# EAGLE design FLT04A (EAGLE 6.5.0)
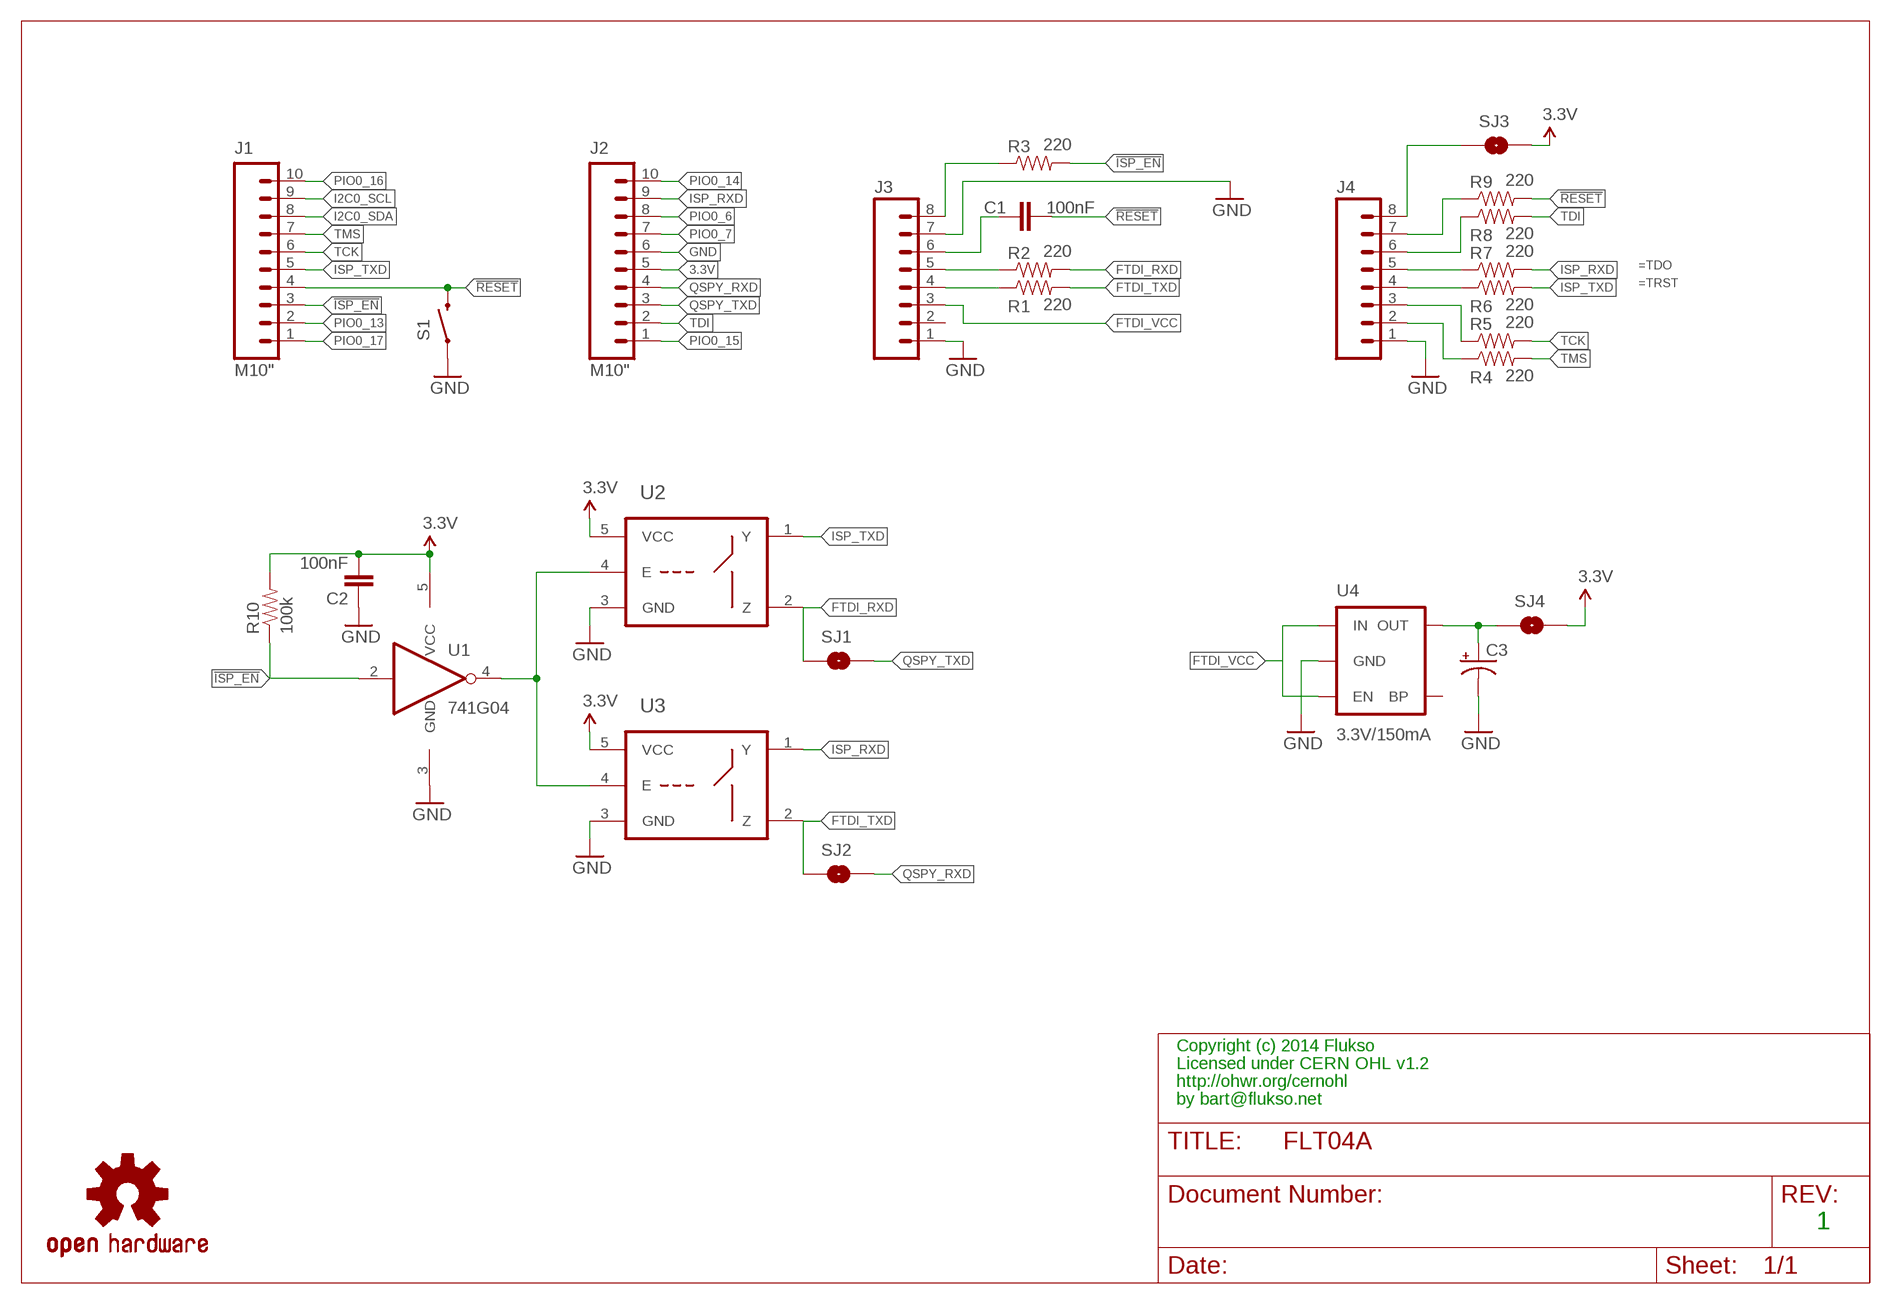
[diagram p0: schematic, sheet 1]

## Parts
C1  100nF  CAP0402-CAP  [0402-CAP]
C2  100nF  CAP0402-CAP  [0402-CAP]
C3  CAP_POL1206  [EIA3216]
J1  M10"  [1X10]
J2  M10"  [1X10]
J3  M08  [1X08_PIN1_NO_SILK]
J4  M08  [1X08_PIN1_NO_SILK]
R1  220  RESISTOR0402-RES  [0402-RES]
R2  220  RESISTOR0402-RES  [0402-RES]
R3  220  RESISTOR0402-RES  [0402-RES]
R4  220  RESISTOR0402-RES  [0402-RES]
R5  220  RESISTOR0402-RES  [0402-RES]
R6  220  RESISTOR0402-RES  [0402-RES]
R7  220  RESISTOR0402-RES  [0402-RES]
R8  220  RESISTOR0402-RES  [0402-RES]
R9  220  RESISTOR0402-RES  [0402-RES]
R10  100k  RESISTOR0402-RES  [0402-RES]
S1  SWITCH-MOMENTARY-2SMD  [TACTILE_SWITCH_SMD]
SJ1  SOLDERJUMPERNC  [SJ_2S]
SJ2  SOLDERJUMPERNC  [SJ_2S]
SJ3  SOLDERJUMPERNC  [SJ_2S]
SJ4  SOLDERJUMPERNC  [SJ_2S]
U1  741G04  [SOT353]
U2  741G66  [SOT353]
U3  741G66  [SOT353]
U4  3.3V/150mA  V_REG_MIC52053.3V  [SOT23-5]
U$1  OSHW-LOGOS  [OSHW-LOGO-S]

## Nets
3.3V: C2.2 J2.5 R10.2 SJ3.2 SJ4.2 U1.5(VCC) U2.5(VCC) U3.5(VCC)
!ISP_EN!: J1.3 R3.2 R10.1 U1.2(I)
!RESET!: C1.2 J1.4 R9.2 S1.3
FTDI_RXD: R2.2 SJ1.1 U2.2(Z)
FTDI_TXD: R1.2 SJ2.1 U3.2(Z)
FTDI_VCC: J3.3 U4.1(IN) U4.3(EN)
GND: C2.1 C3.C(-) J2.6 J3.1 J3.7 J4.1 S1.1 U1.3(GND) U2.3(GND) U3.3(GND) U4.2(GND)
I2C0_SCL: J1.9
I2C0_SDA: J1.8
ISP_RXD: J2.9 R7.2 U3.1(Y)
ISP_TXD: J1.5 R6.2 U2.1(Y)
N$1: J3.8 R3.1
N$2: C1.1 J3.6
N$3: J3.5 R2.1
N$4: J3.4 R1.1
N$5: U1.4(O) U2.4(E) U3.4(E)
N$6: J4.2 R4.1
N$7: J4.3 R5.1
N$8: J4.4 R6.1
N$9: J4.5 R7.1
N$10: J4.6 R8.1
N$11: J4.8 SJ3.1
N$12: J4.7 R9.1
N$15: C3.A(+) SJ4.1 U4.5(OUT)
PIO0_6: J2.8
PIO0_7: J2.7
PIO0_13: J1.2
PIO0_14: J2.10
PIO0_15: J2.1
PIO0_16: J1.10
PIO0_17: J1.1
QSPY_RXD: J2.4 SJ2.2
QSPY_TXD: J2.3 SJ1.2
TCK: J1.6 R5.2
TDI: J2.2 R8.2
TMS: J1.7 R4.2
Unconnected: J3.2 U4.4(BP)

## Notes on the sheet
- =TDO
- =TRST
- Copyright (c) 2014 Flukso
- Licensed under CERN OHL v1.2
- http://ohwr.org/cernohl
- by bart@flukso.net
- 1

## Library data of the parts
C1 C2 = SparkFun-Passives:CAP: Capacitor Standard 0603 ceramic capacitor, and 0.1" leaded capacitor.
C3 = SparkFun-Passives:CAP_POL: Capacitor Polarized These are standard SMD and PTH capacitors. Normally 10uF, 47uF, and 100uF in electrolytic and tantalum varieties. Always verify the external diameter of the through hole cap, it varies with capacity, voltage, and manufacturer. The EIA devices should be standard.
J1 J2 = SparkFun-Connectors:M10: Header 10 Standard 10-pin 0.1" header. Use with straight break away headers (SKU : PRT-00116), right angle break away headers (PRT-00553), swiss pins (PRT-00743), machine pins (PRT-00117), and female headers (PRT-00115).
J3 J4 = SparkFun-Connectors:M08: Header 8 Standard 8-pin 0.1" header. Use with straight break away headers (SKU : PRT-00116), right angle break away headers (PRT-00553), swiss pins (PRT-00743), machine pins (PRT-00117), and female headers (PRT-00115).
R1-R10 = SparkFun-Passives:RESISTOR: Resistor Basic schematic elements and footprints for 0603, 1206, and PTH resistors.
S1 = SparkFun-Electromechanical:SWITCH-MOMENTARY-2: Various NO switches- pushbuttons, reed, etc; PROD_ID: SWCH-08247
SJ1-SJ4 = SparkFun-Passives:SOLDERJUMPER: Solder Jumper Standard SMD solder jumper. Used to automate production. Two varients : Normally Open and Normally Closed are the same, but have different paste layers. NC will have a large amount of paste and should jumper during reflow.
U1 = flukso:74*1G04: Single inverter gate
U2 U3 = flukso:74*1G66: Analog switch
U4 = SparkFun-PowerIC:V_REG_MIC5205: V_REG MIC5219 Standard 3.3V and 5V 150mA LDO voltage regulator in SOT-23 layout. Micrel part MIC5205. BP (by-pass) pin is used to lower output noise with 470pF cap, may be left open.; PROD_ID: VREG-00822
U$1 = sparkFun:OSHW-LOGO: Open Source Hardware Logo This logo indicates the piece of hardware it is found on incorporates a OSHW license and/or adheres to the definition of open source hardware found here: http://freedomdefined.org/OSHW

## Net classes
0 default: width 0.2 mm
1 power: width 0.305 mm

## Board
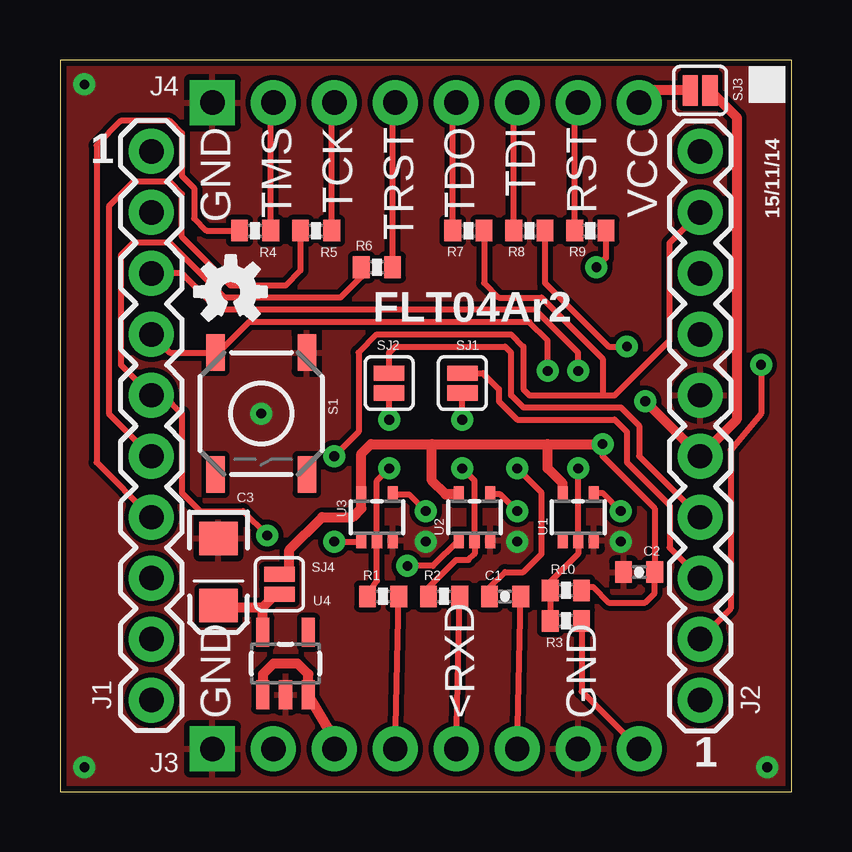
[diagram p1: board, top side]
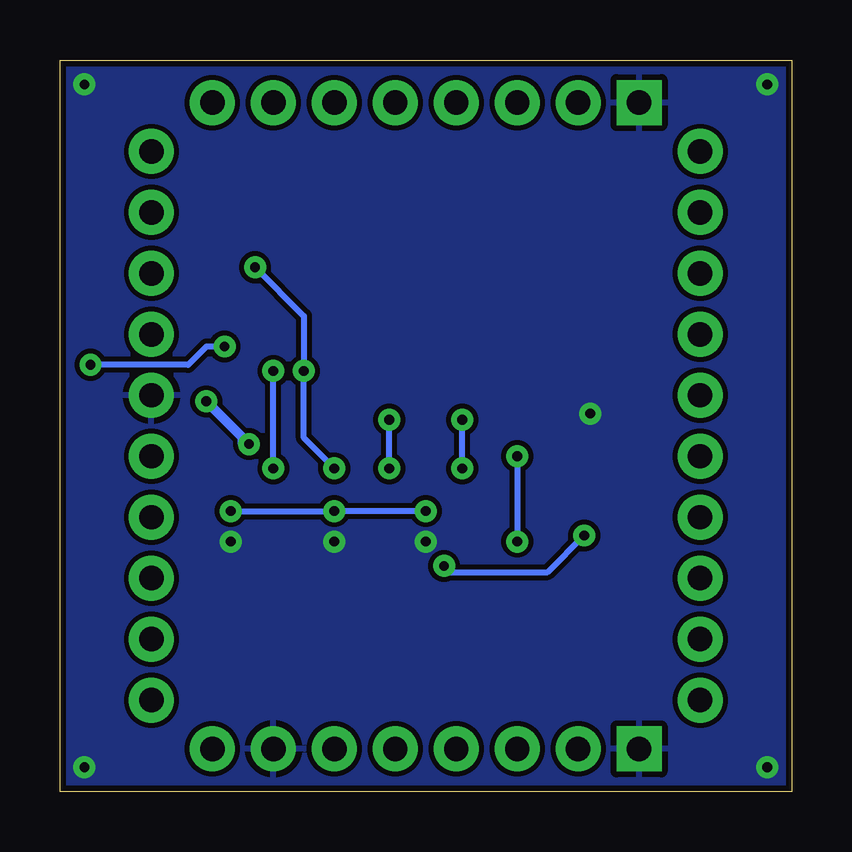
[diagram p2: board, bottom side, seen from below]

Size 30.48 x 30.48 mm. Coordinates in mm from the lower left corner, seen from the top.
Outline: 0,0 30.48,0 30.48,30.48 0,30.48 0,0
Copper layers (1*16): Top 0.035mm / dielectric 1.5mm / Bottom 0.035mm
Design rules "sparkfun": minimum track width 8mil, minimum drill 16mil, track to track 8mil, track to pad 8mil, pad to pad 8mil, via to via 8mil, smd to smd 8mil, copper to edge 10mil, drill to drill 8mil, minimum pad ring 12mil, minimum via ring 10mil, stop-mask expansion 4mil, vias tented up to drill 25mil, thermal gap 10mil

### Footprints (pad centres in the part's own frame; a part is rotated, then mirrored left to right if it is on the bottom)
0402-CAP = smd 0.7 x 0.9: 1 -0.65,0; 2 0.65,0
EIA3216 = smd 1.4 x 1.6: A 1.4,0; C -1.4,0
1X10 = drill 1.016 pad 1.88: 1 0,0; 2 2.54,0; 3 5.08,0; 4 7.62,0; 5 10.16,0; 6 12.7,0; 7 15.24,0; 8 17.78,0; 9 20.32,0; 10 22.86,0
1X08_PIN1_NO_SILK = drill 1.016 pad 1.88 square: 1 0,0 | drill 1.016 pad 1.88: 2 2.54,0; 3 5.08,0; 4 7.62,0; 5 10.16,0; 6 12.7,0; 7 15.24,0; 8 17.78,0
0402-RES = smd 0.7 x 0.9: 1 -0.65,0; 2 0.65,0
TACTILE_SWITCH_SMD = smd 1.524 x 0.762: 1 -2.54,1.905; 2 2.54,1.905; 3 -2.54,-1.905; 4 2.54,-1.905
SJ_2S = smd 0.635 x 1.27: 1 -0.412,0; 2 0.412,0
SOT353 = smd 0.42 x 0.7: 1 -0.65,-0.95; 2 0,-0.95; 3 0.65,-0.95; 4 0.65,0.95; 5 -0.65,0.95
SOT23-5 = smd 0.55 x 1.2: 1 -0.95,-1.3; 2 0,-1.3; 3 0.95,-1.3; 4 0.95,1.3; 5 -0.95,1.3

### Placement (x,y rotation side)
C1  18.54,8.13 180 top
C2  24.13,9.14 0 top
C3  6.6,9.14 270 top
J1  3.81,26.67 270 top
J2  26.67,3.81 90 top
J3  6.35,1.78 0 top
J4  6.35,28.7 0 top
R1  13.46,8.13 180 top
R2  16,8.13 180 top
R3  21.08,7.11 180 top
R4  8.13,23.37 180 top
R5  10.67,23.37 180 top
R6  13.21,21.84 180 top
R7  17.02,23.37 0 top
R8  19.56,23.37 0 top
R9  22.1,23.37 0 top
R10  21.08,8.38 0 top
S1  8.38,15.75 270 top
SJ1  16.76,17.02 90 top
SJ2  13.72,17.02 90 top
SJ3  26.67,29.21 0 top
SJ4  9.14,8.64 90 top
U1  21.59,11.43 0 top
U2  17.27,11.43 0 top
U3  13.21,11.43 0 top
U4  9.4,5.33 0 top
U$1  7.11,20.83 0 top

### Tracks (layer width: path | path; a pad name or v marks a point on that pad's centre or on a via)
3.3V  (via drill 0.41 pad 0.81)
  Top 0.254: v22.61,14.48 22.61,13.97 24.78,11.8 C2.2 24.78,8.27 24.38,7.87 22.86,7.87 22.21,8.52 21.73,8.52 R10.2
  Top 0.406: 15.49,14.48 12.95,14.48 12.56,14.08 U3.5 12.56,11.8 12.19,11.43 10.92,11.43 9.56,10.06 9.56,9.05 SJ4.2 | 15.49,14.48 20.32,14.48 | 20.32,14.48 v22.61,14.48 | U1.5 20.94,12.84 20.32,13.46 20.32,14.48 | U2.5 16.07,12.38 15.49,12.95 15.49,14.48 | SJ3.2 28.19,28.1 28.19,15.49 J2.5 v24.38,16.26
  Bottom 0.406: v22.61,14.48 22.86,14.48 22.86,14.73 v24.38,16.26
!ISP_EN!  (via drill 0.41 pad 0.81)
  Top 0.254: v21.59,13.46 U1.2 21.59,9.91 20.43,8.75 R10.1 R3.2 | v21.59,17.53 21.59,18.29 19.81,20.07 6.6,20.07 5.08,21.59 J1.3
  Bottom 0.254: v21.59,13.46 v21.59,17.53
!RESET!  (via drill 0.41 pad 0.81)
  Top 0.254: v20.32,17.53 20.32,18.8 19.56,19.56 7.87,19.56 6.48,18.16 S1.3 4.57,18.29 J1.4 | R9.2 22.75,22.24 v22.35,21.84 | C1.2 17.89,8.49 18.54,9.14 19.3,9.14 20.07,9.91 20.07,12.45 v19.05,13.46
  Bottom 0.254: v19.05,13.46 20.32,14.73 v20.32,17.53 20.32,19.81 v22.35,21.84
FTDI_RXD  (via drill 0.41 pad 0.81)
  Top 0.254: v16.76,13.46 17.27,12.95 U2.2 17.27,9.91 17.02,9.65 16.51,9.65 15.35,8.49 R2.2 | v16.76,15.49 SJ1.1
  Bottom 0.254: v16.76,13.46 v16.76,15.49
FTDI_TXD  (via drill 0.41 pad 0.81)
  Top 0.254: R1.2 13.21,8.78 U3.2 13.21,12.95 v13.72,13.46 | v13.72,15.49 SJ2.1
  Bottom 0.254: v13.72,13.46 v13.72,15.49
FTDI_VCC
  Top 0.406: J3.3 11.43,2.19 U4.3 10.35,4.89 9.91,5.33 8.89,5.33 8.45,4.89 U4.1
GND  (via drill 0.41 pad 0.61)
  other vias: 29.46,29.46 1.02,1.02 29.46,1.02 1.02,29.46 15.24,10.41 19.05,10.41 23.37,10.41 8.38,15.75
  pour Top: 0,0 0,30.48 30.48,30.48 30.48,0
  pour Bottom: 0,0 0,30.48 30.48,30.48 30.48,0
ISP_RXD  (via drill 0.41 pad 0.81)
  Top 0.254: 22.61,16.51 19.56,16.51 19.3,16.76 19.3,18.54 18.8,19.05 13.21,19.05 12.45,18.29 12.45,14.99 v11.43,13.97 | 22.61,16.51 23.11,16.51 25.4,18.8 25.4,22.86 J2.9 | R7.2 17.67,21.19 18.29,20.57 20.07,20.57 22.61,18.03 22.61,16.51 | v11.43,10.41 12.49,10.41 U3.1
  Bottom 0.254: v11.43,13.97 v11.43,10.41
ISP_TXD  (via drill 0.41 pad 0.81)
  Top 0.254: U2.1 15.54,9.4 v14.48,9.4 | R6.2 12.56,21.45 11.68,20.57 6.86,20.57 4.57,22.86 3.05,22.86 2.54,22.35 2.54,17.78 J1.5 4.32,16.51 5.08,15.75 5.08,12.45 5.84,11.68 7.62,11.68 v8.64,10.67
  Bottom 0.254: v14.48,9.4 14.22,9.14 10.16,9.14 v8.64,10.67
N$1
  Top 0.254: R3.1 21.73,4.18 J3.8
N$2
  Top 0.254: J3.6 C1.1
N$3
  Top 0.254: J3.5 R2.1
N$4
  Top 0.254: J3.4 R1.1
N$5  (via drill 0.41 pad 0.81)
  Top 0.254: U1.4 22.31,12.45 22.61,12.45 v23.37,11.68 | U3.4 14.54,12.38 v15.24,11.68 | v19.05,11.68 18.35,12.38 U2.4
  Bottom 0.254: v15.24,11.68 v19.05,11.68 v23.37,11.68
N$6
  Top 0.254: R4.1 8.78,28.84 J4.2
N$7
  Top 0.254: R5.1 11.32,28.84 J4.3
N$8
  Top 0.254: R6.1 13.86,28.84 J4.4
N$9
  Top 0.254: R7.1 16.37,28.81 J4.5
N$10
  Top 0.254: R8.1 18.91,28.81 J4.6
N$11
  Top 0.406: SJ3.1 24.64,29.21 J4.8
N$12
  Top 0.254: R9.1 21.45,28.81 J4.7
N$15
  Top 0.406: U4.5 8.45,7.69 | C3.A 6.8,7.69 8.45,7.69 | 8.45,7.69 8.99,8.22 SJ4.1
QSPY_RXD
  Top 0.254: SJ2.2 13.72,18.29 13.97,18.54 18.54,18.54 18.8,18.29 18.8,16.51 19.3,16 23.37,16 24.13,15.24 24.13,13.97 J2.4
QSPY_TXD
  Top 0.254: SJ1.2 17.62,17.43 18.29,16.76 18.29,16.26 19.05,15.49 23.11,15.49 23.62,14.99 23.62,13.72 25.4,11.94 25.4,10.16 J2.3
TCK
  Top 0.254: R5.2 10.02,21.7 9.4,21.08 7.11,21.08 5.08,23.11 5.08,24.89 4.57,25.4 3.05,25.4 2.03,24.38 2.03,15.75 J1.6
TDI  (via drill 0.41 pad 0.81)
  Top 0.254: R8.2 20.21,21.19 22.86,18.54 v23.62,18.54 | v29.21,17.78 29.21,15.75 27.94,14.22 27.94,7.62 J2.2
  Bottom 0.254: v23.62,18.54 24.38,18.54 25.15,17.78 v29.21,17.78
TMS
  Top 0.254: 7.37,23.62 R4.2 6.1,23.37 5.59,23.88 5.59,25.15 5.08,25.65 5.08,27.43 4.57,27.94 2.54,27.94 1.52,26.92 1.52,13.72 J1.7

### Text on the board
tPlace: GND | TMS | TCK | TRST | TDO | TDI | RST | VCC | 15/11/14 | FLT04Ar2 | GND | <RXD | GND
tNames: 1 | 1